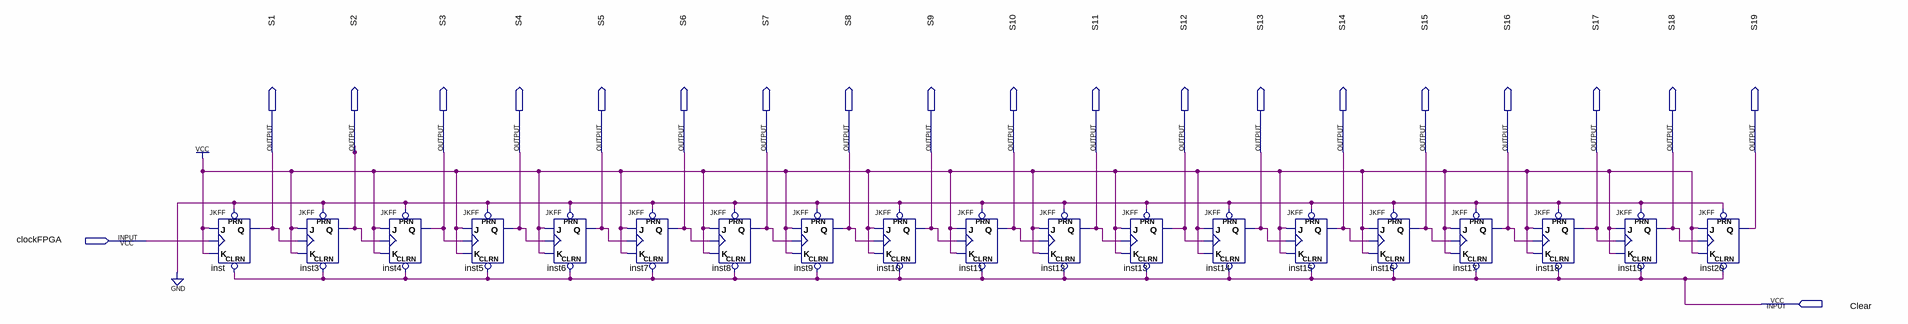
[diagram p0: schematic sheet]
// Quartus schematic contadorPulso.bdf as structural Verilog: 19 symbols, 21 pins
module contadorPulso (
  input  clockFPGA,
  input  Clear,
  output S1,
  output S2,
  output S3,
  output S4,
  output S5,
  output S6,
  output S7,
  output S8,
  output S9,
  output S10,
  output S11,
  output S12,
  output S13,
  output S14,
  output S15,
  output S16,
  output S17,
  output S18,
  output S19
);

  JKFF inst (.PRN(1'b0), .CLRN(Clear), .K(1'b1), .J(1'b1), .CLK(clockFPGA), .Q(S1));
  JKFF inst3 (.PRN(1'b0), .CLRN(Clear), .K(1'b1), .J(1'b1), .CLK(S1), .Q(S2));
  JKFF inst4 (.PRN(1'b0), .CLRN(Clear), .K(1'b1), .J(1'b1), .CLK(S2), .Q(S3));
  JKFF inst5 (.PRN(1'b0), .CLRN(Clear), .K(1'b1), .J(1'b1), .CLK(S3), .Q(S4));
  JKFF inst6 (.PRN(1'b0), .CLRN(Clear), .K(1'b1), .J(1'b1), .CLK(S4), .Q(S5));
  JKFF inst7 (.PRN(1'b0), .CLRN(Clear), .K(1'b1), .J(1'b1), .CLK(S5), .Q(S6));
  JKFF inst8 (.PRN(1'b0), .CLRN(Clear), .K(1'b1), .J(1'b1), .CLK(S6), .Q(S7));
  JKFF inst9 (.PRN(1'b0), .CLRN(Clear), .K(1'b1), .J(1'b1), .CLK(S7), .Q(S8));
  JKFF inst10 (.PRN(1'b0), .CLRN(Clear), .K(1'b1), .J(1'b1), .CLK(S8), .Q(S9));
  JKFF inst11 (.PRN(1'b0), .CLRN(Clear), .K(1'b1), .J(1'b1), .CLK(S9), .Q(S10));
  JKFF inst12 (.PRN(1'b0), .CLRN(Clear), .K(1'b1), .J(1'b1), .CLK(S10), .Q(S11));
  JKFF inst13 (.PRN(1'b0), .CLRN(Clear), .K(1'b1), .J(1'b1), .CLK(S11), .Q(S12));
  JKFF inst14 (.PRN(1'b0), .CLRN(Clear), .K(1'b1), .J(1'b1), .CLK(S12), .Q(S13));
  JKFF inst15 (.PRN(1'b0), .CLRN(Clear), .K(1'b1), .J(1'b1), .CLK(S13), .Q(S14));
  JKFF inst16 (.PRN(1'b0), .CLRN(Clear), .K(1'b1), .J(1'b1), .CLK(S14), .Q(S15));
  JKFF inst17 (.PRN(1'b0), .CLRN(Clear), .K(1'b1), .J(1'b1), .CLK(S15), .Q(S16));
  JKFF inst18 (.PRN(1'b0), .CLRN(Clear), .K(1'b1), .J(1'b1), .CLK(S16), .Q(S17));
  JKFF inst19 (.PRN(1'b0), .CLRN(Clear), .K(1'b1), .J(1'b1), .CLK(S17), .Q(S18));
  JKFF inst20 (.PRN(1'b0), .CLRN(Clear), .K(1'b1), .J(1'b1), .CLK(S18), .Q(S19));
endmodule
